# Altium schematic sheet debug-header.SchDoc: Debug Header
size Legal; CheckedBy: J. Brinton; CompanyName: Signal Laboratories, Inc.; DrawnBy: J. Brinton; Engineer: J. Brinton; Address1: 3479 Edison Way; Address2: Menlo Park CA 94025; Address3: +1 (877) 778-8435; Address4: siglabs.com; DocumentNumber: 24; Revision: 2b; SheetNumber: 25; SheetTotal: 58
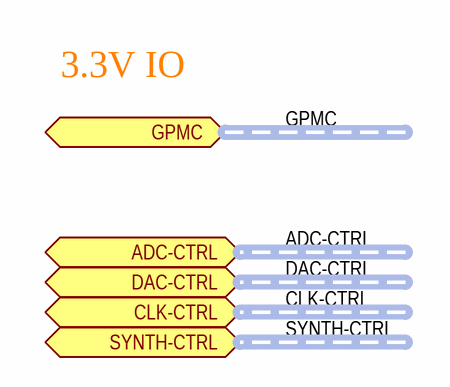
[diagram p0: debug-header.SchDoc]

## Ports
ADC-CTRL (harness ADC-CTRL-1V8), CLK-CTRL (harness CLK-CTRL), DAC-CTRL (harness DAC-CTRL), GPMC (harness GPMC), SYNTH-CTRL (harness SYNTH-CTRL)

## Buses and harness runs
harness ADC-CTRL = port ADC-CTRL
harness CLK-CTRL = port CLK-CTRL
harness DAC-CTRL = port DAC-CTRL
harness GPMC = port GPMC
harness SYNTH-CTRL = port SYNTH-CTRL

## Notes on the sheet
- 3.3V IO
- Title
- Engineer
- Revision
- Drawn By
- Checked By
- Date
- Sheet
- of